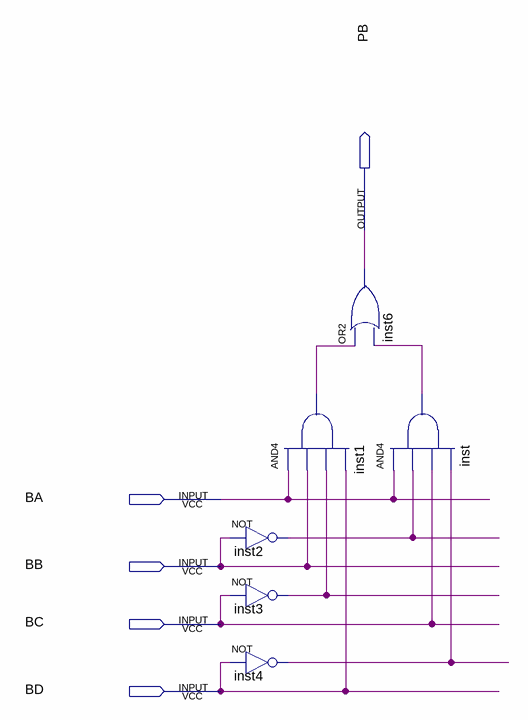
[diagram p0: schematic sheet]
// Quartus schematic ColunaB.bdf as structural Verilog: 6 symbols, 5 pins
module ColunaB (
  input  BA,
  input  BB,
  input  BC,
  input  BD,
  output PB
);

  wire inst1_out, inst2_out, inst3_out, inst4_out, inst_out;

  and inst1 (inst1_out, BA, BB, inst3_out, BD);
  not inst2 (inst2_out, BB);
  not inst3 (inst3_out, BC);
  not inst4 (inst4_out, BD);
  or inst6 (PB, inst1_out, inst_out);
  and inst (inst_out, BA, inst2_out, BC, inst4_out);
endmodule
